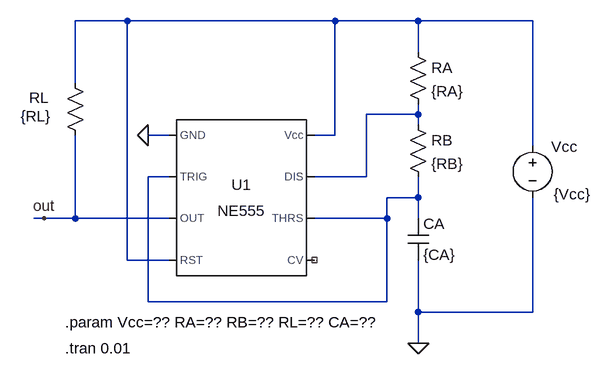
[diagram p0: schematic NE55501fig.asc]
NE55501fig.asc, the LTspice schematic file:
Version 4
SHEET 1 880 680
WIRE 64 -64 -16 -64
WIRE 384 -64 64 -64
WIRE 512 -64 384 -64
WIRE 688 -64 512 -64
WIRE 512 -16 512 -64
WIRE -16 32 -16 -64
WIRE 512 80 512 64
WIRE 512 80 432 80
WIRE 512 96 512 80
WIRE 128 112 96 112
WIRE 384 112 384 -64
WIRE 384 112 352 112
WIRE 688 128 688 -64
WIRE 128 176 96 176
WIRE 432 176 432 80
WIRE 432 176 352 176
WIRE 512 208 512 176
WIRE 512 208 464 208
WIRE -64 240 -80 240
WIRE -16 240 -16 112
WIRE -16 240 -64 240
WIRE 128 240 -16 240
WIRE 464 240 464 208
WIRE 464 240 352 240
WIRE 512 240 512 208
WIRE 64 304 64 -64
WIRE 128 304 64 304
WIRE 96 368 96 176
WIRE 464 368 464 240
WIRE 464 368 96 368
WIRE 512 384 512 304
WIRE 688 384 688 208
WIRE 688 384 512 384
WIRE 512 432 512 384
FLAG 96 112 0
FLAG 512 432 0
FLAG -64 240 out
SYMBOL Misc\\NE555 240 208 R0
SYMATTR InstName U1
SYMBOL res 496 -32 R0
SYMATTR InstName RA
SYMATTR Value {RA}
SYMBOL res 496 80 R0
SYMATTR InstName RB
SYMATTR Value {RB}
SYMBOL voltage 688 112 R0
WINDOW 0 29 18 Left 2
WINDOW 3 33 91 Left 2
SYMATTR InstName Vcc
SYMATTR Value {Vcc}
SYMBOL cap 496 240 R0
SYMATTR InstName CA
SYMATTR Value {CA}
SYMBOL res -32 16 R0
WINDOW 0 -55 38 Left 2
WINDOW 3 -68 67 Left 2
SYMATTR InstName RL
SYMATTR Value {RL}
TEXT -32 400 Left 2 !.param Vcc=?? RA=?? RB=?? RL=?? CA=??
TEXT -32 440 Left 2 !.tran 0.01

The netlist it stands for:
* NE55501fig.asc
XU1 0 N003 out N001 NC_01 N003 N002 N001 NE555  ; pins GND TRIG OUT RST CV THRS DIS Vcc
RA N001 N002 {RA}
RB N002 N003 {RB}
Vcc N001 0 {Vcc}
CA N003 0 {CA}
RL N001 out {RL}
.param Vcc=?? RA=?? RB=?? RL=?? CA=??
.tran 0.01
.lib NE555.sub
.backanno
.end